# Altium schematic sheet mosfets.SchDoc
size A4
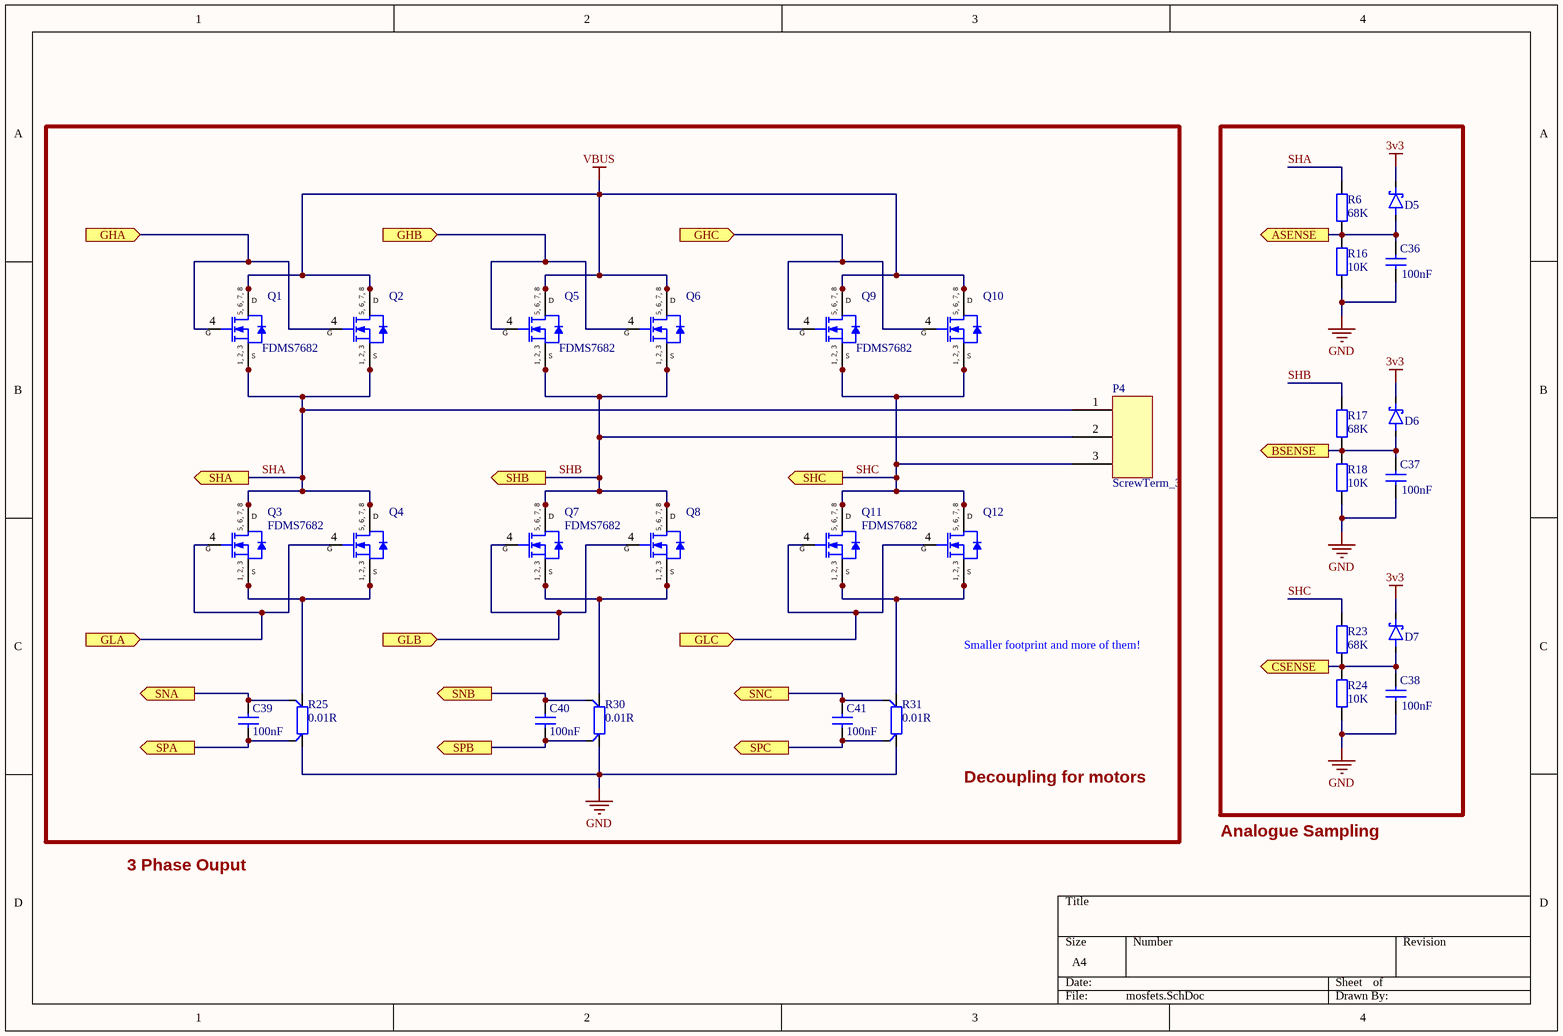
[diagram p0: mosfets.SchDoc]

## Parts
C36  100nF  [CAP0402(1005)_N]
C37  100nF  [CAP0402(1005)_N]
C38  100nF  [CAP0402(1005)_N]
C39  100nF  [CAP0402(1005)_N]
C40  100nF  [CAP0402(1005)_N]
C41  100nF  [CAP0402(1005)_N]
D5  Diode_schottky  [SOD523]  (value not drawn)
D6  Diode_schottky  [SOD523]  (value not drawn)
D7  Diode_schottky  [SOD523]  (value not drawn)
P4  ScrewTerm_3  [ScrewTerm_3]
Q1  FDMS7682  [PQFN8_5x6]
Q2  FDMS7682  [PQFN8_5x6]  (value not drawn)
Q3  FDMS7682  [PQFN8_5x6]
Q4  FDMS7682  [PQFN8_5x6]  (value not drawn)
Q5  FDMS7682  [PQFN8_5x6]
Q6  FDMS7682  [PQFN8_5x6]  (value not drawn)
Q7  FDMS7682  [PQFN8_5x6]
Q8  FDMS7682  [PQFN8_5x6]  (value not drawn)
Q9  FDMS7682  [PQFN8_5x6]
Q10  FDMS7682  [PQFN8_5x6]  (value not drawn)
Q11  FDMS7682  [PQFN8_5x6]
Q12  FDMS7682  [PQFN8_5x6]  (value not drawn)
R6  68K  [RESC0402(1005)_N]
R16  10K  [RESC0402(1005)_N]
R17  68K  [RESC0402(1005)_N]
R18  10K  [RESC0402(1005)_N]
R23  68K  [RESC0402(1005)_N]
R24  10K  [RESC0402(1005)_N]
R25  0.01R  [RESC1206_kelvin]
R30  0.01R  [RESC1206_kelvin]
R31  0.01R  [RESC1206_kelvin]

## Blocks framed on the sheet
Decoupling for motors: C39-C41 P4 Q1-Q12 R25 R30 R31

## Ports
ASENSE (out), BSENSE (out), CSENSE (out), GHA (in), GHB (in), GHC (in), GLA (in), GLB (in), GLC (in), SHA (out), SHB (out), SHC (out), SNA (out), SNB (out), SNC (out), SPA (out), SPB (out), SPC (out)

## Nets
3v3: D5.1 D6.1 D7.1
GND: C36.1 C37.1 C38.1 R16.1 R18.1 R24.1 R25.2 R30.2 R31.2
VBUS: Q1.0(D) Q1.5(D) Q1.6(D) Q1.7(D) Q1.8(D) Q2.0(D) Q2.5(D) Q2.6(D) Q2.7(D) Q2.8(D) Q5.0(D) Q5.5(D) Q5.6(D) Q5.7(D) Q5.8(D) Q6.0(D) Q6.5(D) Q6.6(D) Q6.7(D) Q6.8(D) Q9.0(D) Q9.5(D) Q9.6(D) Q9.7(D) Q9.8(D) Q10.0(D) Q10.5(D) Q10.6(D) Q10.7(D) Q10.8(D)
ASENSE: C36.2 D5.2 R6.1 R16.2 ; port ASENSE
BSENSE: C37.2 D6.2 R17.1 R18.2 ; port BSENSE
CSENSE: C38.2 D7.2 R23.1 R24.2 ; port CSENSE
GHA: Q1.4(G) Q2.4(G) ; port GHA
GHB: Q5.4(G) Q6.4(G) ; port GHB
GHC: Q9.4(G) Q10.4(G) ; port GHC
GLA: Q3.4(G) Q4.4(G) ; port GLA
GLB: Q7.4(G) Q8.4(G) ; port GLB
GLC: Q11.4(G) Q12.4(G) ; port GLC
SHA: P4.1 Q1.1(S) Q1.2(S) Q1.3(S) Q2.1(S) Q2.2(S) Q2.3(S) Q3.0(D) Q3.5(D) Q3.6(D) Q3.7(D) Q3.8(D) Q4.0(D) Q4.5(D) Q4.6(D) Q4.7(D) Q4.8(D) R6.2 ; port SHA
SHB: P4.2 Q5.1(S) Q5.2(S) Q5.3(S) Q6.1(S) Q6.2(S) Q6.3(S) Q7.0(D) Q7.5(D) Q7.6(D) Q7.7(D) Q7.8(D) Q8.0(D) Q8.5(D) Q8.6(D) Q8.7(D) Q8.8(D) R17.2 ; port SHB
SHC: P4.3 Q9.1(S) Q9.2(S) Q9.3(S) Q10.1(S) Q10.2(S) Q10.3(S) Q11.0(D) Q11.5(D) Q11.6(D) Q11.7(D) Q11.8(D) Q12.0(D) Q12.5(D) Q12.6(D) Q12.7(D) Q12.8(D) R23.2 ; port SHC
SNA: C39.2 R25.3 ; port SNA
SNB: C40.2 R30.3 ; port SNB
SNC: C41.2 R31.3 ; port SNC
SPA: C39.1 R25.4 ; port SPA
SPB: C40.1 R30.4 ; port SPB
SPC: C41.1 R31.4 ; port SPC
NetQ3_1: Q3.1(S) Q3.2(S) Q3.3(S) Q4.1(S) Q4.2(S) Q4.3(S) R25.1
NetQ7_1: Q7.1(S) Q7.2(S) Q7.3(S) Q8.1(S) Q8.2(S) Q8.3(S) R30.1
NetQ11_1: Q11.1(S) Q11.2(S) Q11.3(S) Q12.1(S) Q12.2(S) Q12.3(S) R31.1

## Notes on the sheet
- Smaller footprint and more of them!
- Analogue Sampling
- 3 Phase Ouput
- (in symbol FDMS7682) 5, 6, 7, 8; 1, 2, 3

## Library data of the parts
C36-C41 = cap_generic: Capacitor; Part: cap_generic; PartValue: 100nF; Mounting Technology: Surface Mount
R6 R16-R18 R23 R24 = res_generic: Resistor; PartNumber: *; Manufacturer: *; Mounting Technology: Surface Mount; Digikey Part Number: *; Part: res_generic
  R6 R17 R23: PartValue: 68K
  R16 R18 R24: PartValue: 10K
R25 R30 R31 = Generic_res_kelvin: Kelvin connection resistor; Manufacturer: *; Mounting Technology: Surface Mount; PartNumber: *; PartValue: 0.01R; Digikey Part Number: *; Part: Generic_res_kelvin